# EAGLE schematic TricolorUsbSignal-basic (EAGLE 6.3)
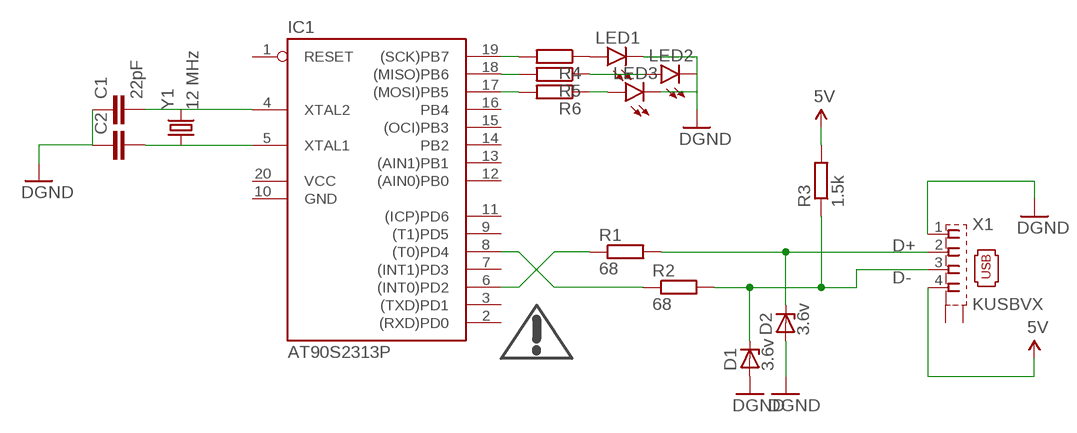
[diagram p0: schematic, sheet 1]

## Parts
C1  22pF  CAP0402-CAP  [0402-CAP]
C2  CAP0402-CAP  [0402-CAP]
D1  3.6v  ZENER-DIODEC1702-15  [C1702-15]
D2  3.6v  ZENER-DIODEC1702-15  [C1702-15]
IC1  AT90S2313P  [DIL20]
LED1  LED3MM  [LED3MM]
LED2  LED3MM  [LED3MM]
LED3  LED3MM  [LED3MM]
R1  68  R-EU_0204/7  [0204/7]
R2  68  R-EU_0204/7  [0204/7]
R3  1.5k  R-EU_0204/7  [0204/7]
R4  R-EU_0204/7  [0204/7]
R5  R-EU_0204/7  [0204/7]
R6  R-EU_0204/7  [0204/7]
X1  KUSBVX  [KUSBVX]
Y1  12 MHz  CRYSTALHC49UV  [HC49U-V]

## Nets
5V: R3.2 X1.4
GND: C1.1 C2.1 D1.A D2.A LED1.K(C) LED2.K(C) LED3.K(C) X1.1 ; supply symbol labelled DGND
N$1: C1.2 IC1.4(XTAL2) Y1.2
N$2: C2.2 IC1.5(XTAL1) Y1.1
N$3: IC1.6((INT0)PD2) R1.1
N$4: IC1.8((T0)PD4) R2.1
N$5: LED1.A R4.1
N$6: D1.C R2.2 R3.1 X1.3
N$7: D2.C R1.2 X1.2
N$8: LED3.A R6.1
N$9: IC1.19((SCK)PB7) R4.2
N$10: IC1.18((MISO)PB6) R5.2
N$11: IC1.17((MOSI)PB5) R6.2
N$12: LED2.A R5.1
Unconnected: IC1.1(RESET) IC1.2((RXD)PD0) IC1.3((TXD)PD1) IC1.7((INT1)PD3) IC1.9((T1)PD5) IC1.11((ICP)PD6) IC1.12((AIN0)PB0) IC1.13((AIN1)PB1) IC1.14(PB2) IC1.15((OCI)PB3) IC1.16(PB4) X1.M1(S1) X1.M2(S2)

## Notes on the sheet
- D+
- D-

## Power pins joined to a net without a drawn wire
GND: IC1.10(GND)
VCC: IC1.20(VCC)

## Library data of the parts
C1 C2 = SparkFun-Passives:CAP: Capacitor Standard 0603 ceramic capacitor, and 0.1" leaded capacitor.
D1 D2 = diode:ZENER-DIODE: Z-Diode
IC1 = atmel:AT90S2313: MICROCONTROLLER 2 Kbytes FLASH 128 bytes SRAM 128 bytes EEPROM UART; OC_FARNELL: unknown; OC_NEWARK: unknown
LED1-LED3 = SparkFun-LED:LED: LEDs Standard schematic elements and footprints for 5mm, 3mm, 1206, and 0603 sized LEDs. 5mm - Spark Fun Electronics SKU : COM-00529 (and others)
R1-R6 = resistor:R-EU_: RESISTOR, European symbol
X1 = con-kycon:KUSBVX: Vertical,Top Entry Universal Serial Bus Connector KUSBVX Series Source: KYCON Sibalco USB vertical socket KUSBV.pdf
Y1 = SparkFun-FreqCtrl:CRYSTAL: Various standard crystals. Proven footprints.